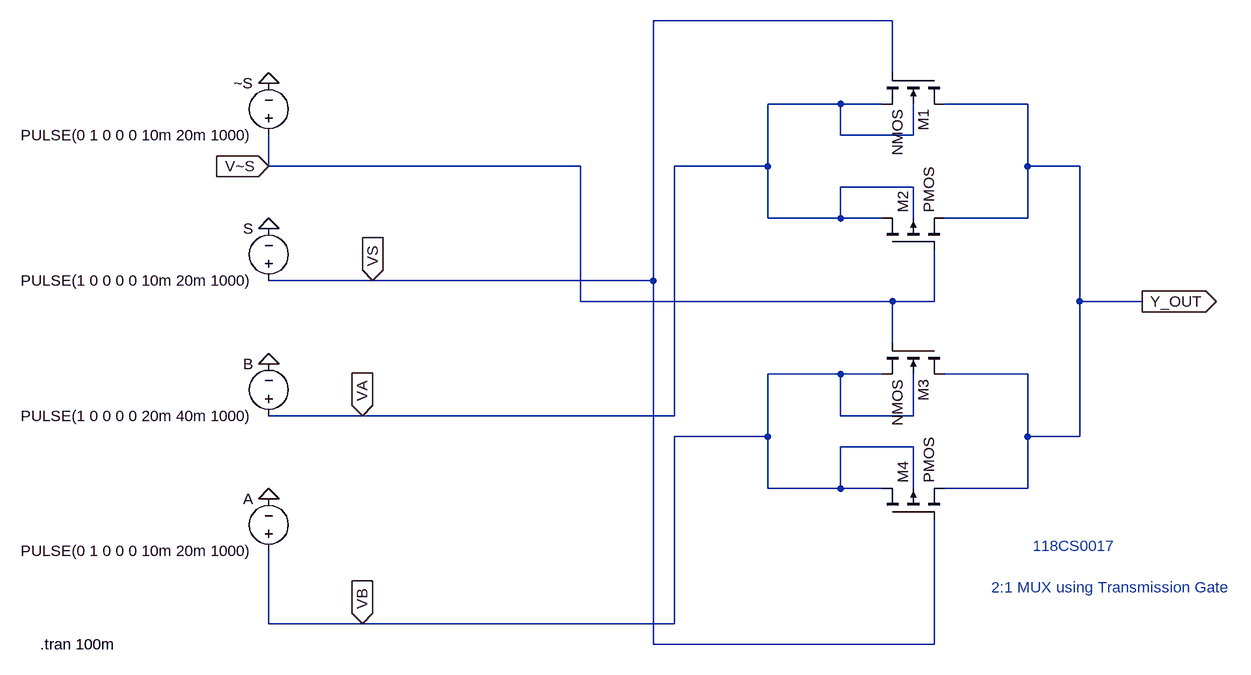
[diagram p0: schematic Draft12.asc]
Draft12.asc, the LTspice schematic file:
Version 4
SHEET 1 1752 1008
WIRE 176 0 -192 0
WIRE 176 80 176 0
WIRE 96 128 -16 128
WIRE 160 128 96 128
WIRE 384 128 256 128
WIRE 96 176 96 128
WIRE 208 176 208 128
WIRE 208 176 96 176
WIRE -784 224 -784 176
WIRE -304 224 -784 224
WIRE -16 224 -16 128
WIRE -16 224 -160 224
WIRE 384 224 384 128
WIRE 464 224 384 224
WIRE 208 256 96 256
WIRE -16 304 -16 224
WIRE 96 304 96 256
WIRE 96 304 -16 304
WIRE 160 304 96 304
WIRE 208 304 208 256
WIRE 384 304 384 224
WIRE 384 304 256 304
WIRE -624 400 -784 400
WIRE -192 400 -192 0
WIRE -192 400 -624 400
WIRE -304 432 -304 224
WIRE 176 432 -304 432
WIRE 240 432 240 352
WIRE 240 432 176 432
WIRE 464 432 464 224
WIRE 560 432 464 432
WIRE 176 496 176 432
WIRE 96 544 -16 544
WIRE 160 544 96 544
WIRE 384 544 256 544
WIRE -640 608 -784 608
WIRE -160 608 -160 224
WIRE -160 608 -640 608
WIRE 96 608 96 544
WIRE 208 608 208 544
WIRE 208 608 96 608
WIRE -16 640 -16 544
WIRE -16 640 -160 640
WIRE 384 640 384 544
WIRE 464 640 464 432
WIRE 464 640 384 640
WIRE 208 656 96 656
WIRE -16 720 -16 640
WIRE 96 720 96 656
WIRE 96 720 -16 720
WIRE 160 720 96 720
WIRE 208 720 208 656
WIRE 384 720 384 640
WIRE 384 720 256 720
WIRE -784 928 -784 816
WIRE -640 928 -784 928
WIRE -160 928 -160 640
WIRE -160 928 -640 928
WIRE -192 960 -192 400
WIRE 240 960 240 768
WIRE 240 960 -192 960
FLAG 560 432 Y_OUT
IOPIN 560 432 Out
FLAG -784 528 0
FLAG -784 320 0
FLAG -784 96 0
FLAG -784 736 0
FLAG -784 224 V~S
IOPIN -784 224 In
FLAG -624 400 VS
IOPIN -624 400 In
FLAG -640 608 VA
IOPIN -640 608 In
FLAG -640 928 VB
IOPIN -640 928 In
SYMBOL nmos4 256 80 R90
SYMATTR InstName M1
SYMBOL pmos4 160 352 R270
SYMATTR InstName M2
SYMBOL nmos4 256 496 R90
SYMATTR InstName M3
SYMBOL pmos4 160 768 R270
SYMATTR InstName M4
SYMBOL voltage -784 832 R180
WINDOW 0 24 96 Left 2
WINDOW 3 24 16 Left 2
WINDOW 123 0 0 Left 0
WINDOW 39 0 0 Left 0
SYMATTR InstName A
SYMATTR Value PULSE(0 1 0 0 0 10m 20m 1000)
SYMBOL voltage -784 624 R180
WINDOW 0 24 96 Left 2
WINDOW 3 24 16 Left 2
WINDOW 123 0 0 Left 0
WINDOW 39 0 0 Left 0
SYMATTR InstName B
SYMATTR Value PULSE(1 0 0 0 0 20m 40m 1000)
SYMBOL voltage -784 416 R180
WINDOW 0 24 96 Left 2
WINDOW 3 24 16 Left 2
WINDOW 123 0 0 Left 0
WINDOW 39 0 0 Left 0
SYMATTR InstName S
SYMATTR Value PULSE(1 0 0 0 0 10m 20m 1000)
SYMBOL voltage -784 192 R180
WINDOW 0 24 96 Left 2
WINDOW 3 24 16 Left 2
WINDOW 123 0 0 Left 0
WINDOW 39 0 0 Left 0
SYMATTR InstName ~S
SYMATTR Value PULSE(0 1 0 0 0 10m 20m 1000)
TEXT -1136 960 Left 2 !.tran 100m
TEXT 392 808 Left 2 ;118CS0017
TEXT 328 872 Left 2 ;2:1 MUX using Transmission Gate

The netlist it stands for:
* Draft12.asc
M1 Y_OUT VS VA VA NMOS
M2 VA V~S Y_OUT VA PMOS
M3 Y_OUT V~S VB VB NMOS
M4 VB VS Y_OUT VB PMOS
V§A VB 0 PULSE(0 1 0 0 0 10m 20m 1000)
V§B VA 0 PULSE(1 0 0 0 0 20m 40m 1000)
V§S VS 0 PULSE(1 0 0 0 0 10m 20m 1000)
V§~S V~S 0 PULSE(0 1 0 0 0 10m 20m 1000)
.model NMOS NMOS
.model PMOS PMOS
.lib standard.mos
.tran 100m
* 118CS0017
* 2:1 MUX using Transmission Gate
.backanno
.end